# EAGLE design LED_Brightness_Adjuster (EAGLE 9.6.2)
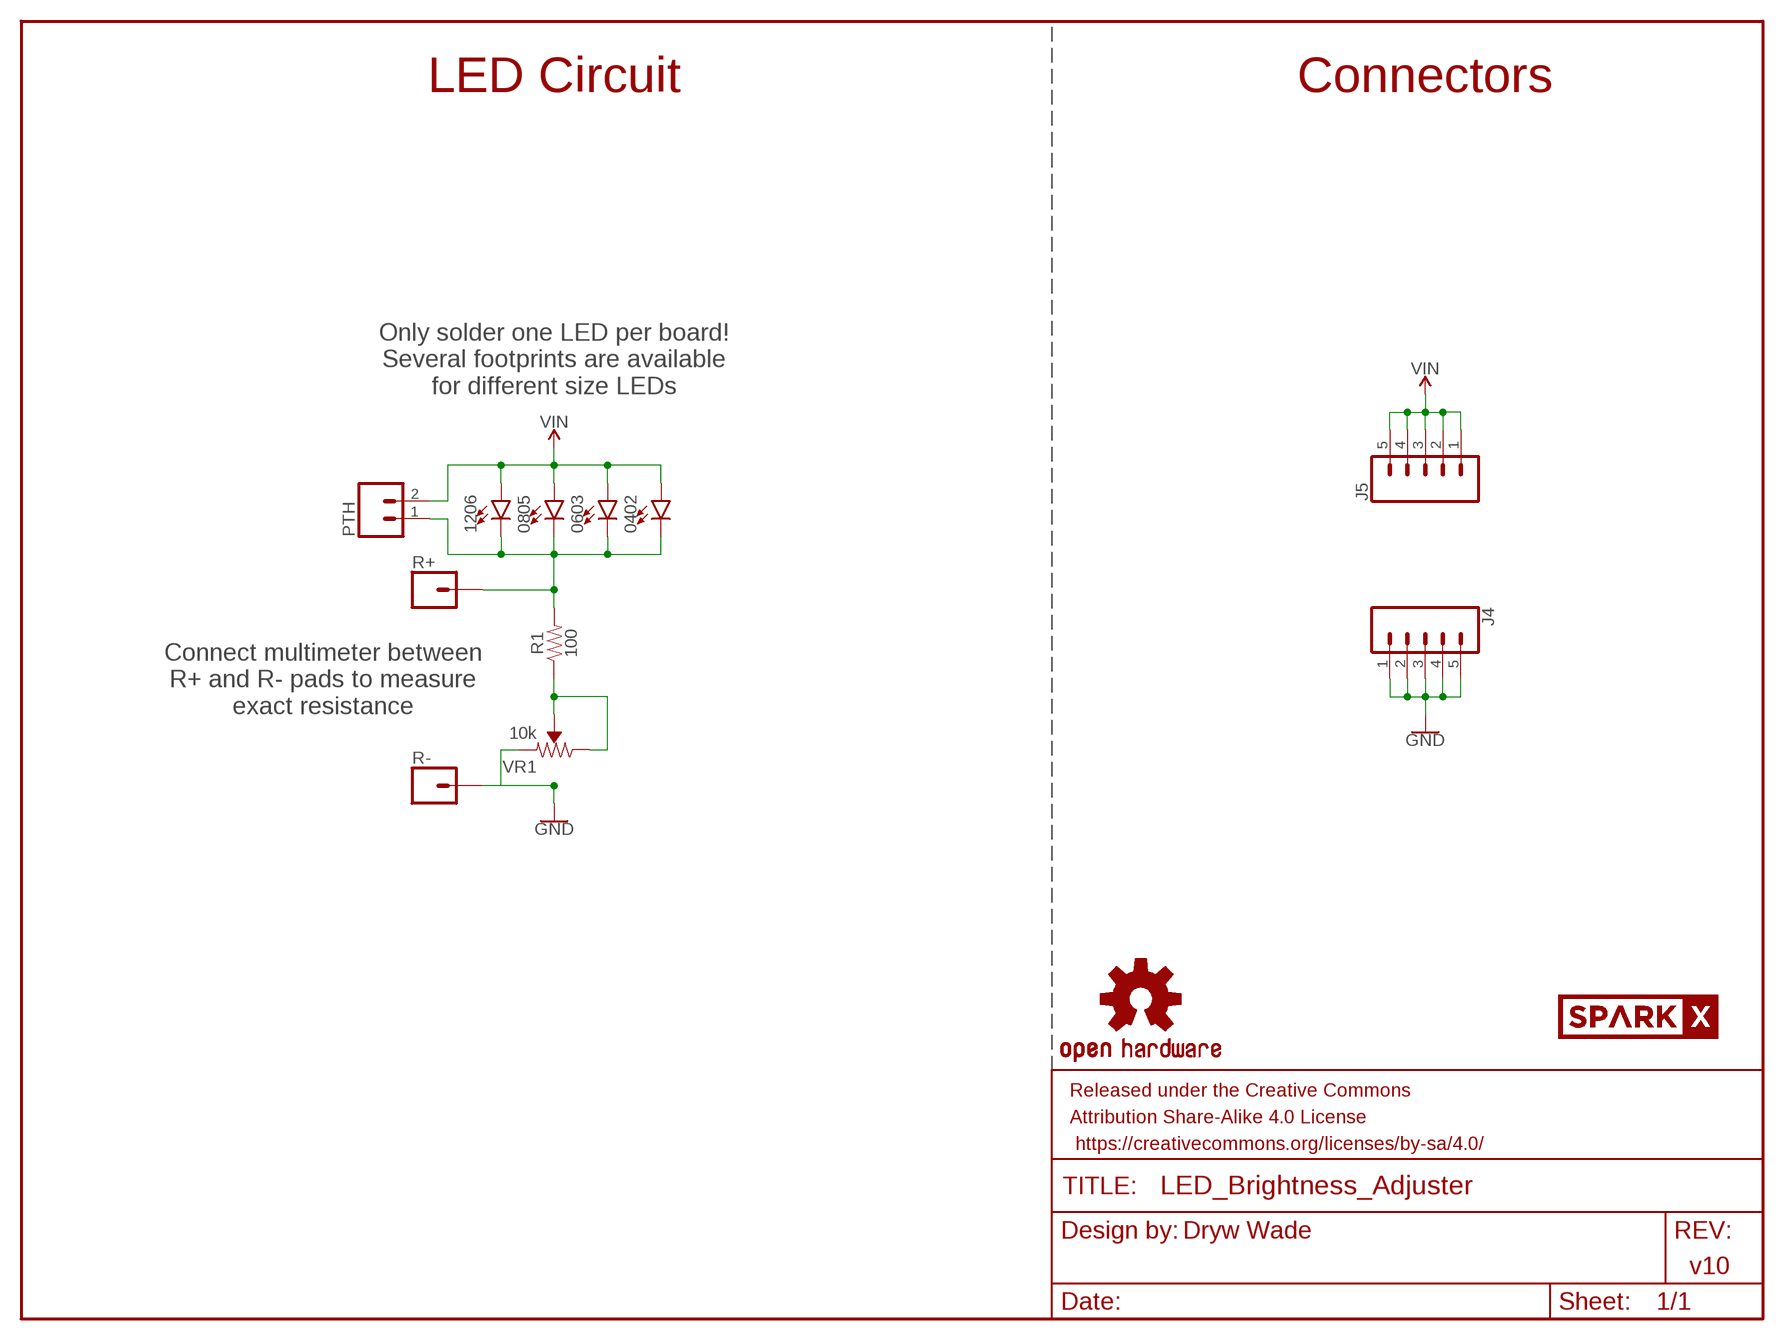
[diagram p0: schematic, sheet 1]

## Parts
0402  RED  LED-RED_0402  [LED-0402]
0603  RED  LED-RED0603  [LED-0603]
0805  RED  LED-RED-0805  [LED-0805]
1206  RED  LED-RED1206  [LED-1206]
FRAME1  FRAME-LETTER  [CREATIVE_COMMONS]
J4  CONN_05  [1X05]
J5  CONN_05  [1X05]
LOGO2  OSHW-LOGOS  [OSHW-LOGO-S]
PTH  CONN_02  [1X02]
R1  100  100OHM-HORIZ-1/4W-1%  [AXIAL-0.3]
R+  CONN_01  [1X01]
R-  CONN_01  [1X01]
U$26  SPARKX-LOGO5  [SPARKX-LARGE]
U$27  SPARKX-LOGO5  [SPARKX-LARGE]
VR1  10k  TRIMPOT-PTH-10MM-KNOB-1/2W-10%  [TRIMPOT-PTH-3386U]

## Nets
GND: J4.1 J4.2 J4.3 J4.4 J4.5 R-.1 VR1.1(CCW)
N$1: 0402.C 0603.C 0805.C 1206.C PTH.1 R1.P$2 R+.1
N$2: R1.P$1 VR1.2(WIPER) VR1.3(CW)
VIN: 0402.A 0603.A 0805.A 1206.A J5.1 J5.2 J5.3 J5.4 J5.5 PTH.2

## Notes on the sheet
- LED Circuit | Connectors
- Only solder one LED per board\!
  Several footprints are available
  for different size LEDs
- Connect multimeter between
  R+ and R- pads to measure
  exact resistance
- Dryw Wade
- v10

## Library data of the parts
0402 = SparkFun-LED:LED-RED: Red SMD LED Used in manufacturing of most products at SparkFun Packages: 0603 - SMD 0603 package [Product Link] <http://docs.avagotech.com/docs/AV02-0551EN> 0603 SMART - SMD 0603 SMART package ( more efficient and expensive)[Product Link] <http://www.osram-os.com/Graphics/XPic2/00077099_0.pdf> 1206 - SMD1206 package [Product Link] <https://www.sparkfun.com/datasheets/DevTools/LilyPad/Q150OVS4.pdff> SparkFun Products: Pro Mini 328 -5V <https://www.sparkfun.com/products/821> RedBoard <https://www.sparkfun.com/products/12757> IOIO-OTG <https://www.sparkfun.com/products/13613>; PROD_ID: DIO-16757
0603 = SparkFun-LED:LED-RED: Red SMD LED Used in manufacturing of most products at SparkFun Packages: 0603 - SMD 0603 package [Product Link] <http://docs.avagotech.com/docs/AV02-0551EN> 0603 SMART - SMD 0603 SMART package ( more efficient and expensive)[Product Link] <http://www.osram-os.com/Graphics/XPic2/00077099_0.pdf> 1206 - SMD1206 package [Product Link] <https://www.sparkfun.com/datasheets/DevTools/LilyPad/Q150OVS4.pdff> SparkFun Products: Pro Mini 328 -5V <https://www.sparkfun.com/products/821> RedBoard <https://www.sparkfun.com/products/12757> IOIO-OTG <https://www.sparkfun.com/products/13613>; PROD_ID: DIO-00819
0805 = SparkFun-LED:LED-RED: Red SMD LED Used in manufacturing of most products at SparkFun Packages: 0603 - SMD 0603 package [Product Link] <http://docs.avagotech.com/docs/AV02-0551EN> 0603 SMART - SMD 0603 SMART package ( more efficient and expensive)[Product Link] <http://www.osram-os.com/Graphics/XPic2/00077099_0.pdf> 1206 - SMD1206 package [Product Link] <https://www.sparkfun.com/datasheets/DevTools/LilyPad/Q150OVS4.pdff> SparkFun Products: Pro Mini 328 -5V <https://www.sparkfun.com/products/821> RedBoard <https://www.sparkfun.com/products/12757> IOIO-OTG <https://www.sparkfun.com/products/13613>; PROD_ID: DIO-16865
1206 = SparkFun-LED:LED-RED: Red SMD LED Used in manufacturing of most products at SparkFun Packages: 0603 - SMD 0603 package [Product Link] <http://docs.avagotech.com/docs/AV02-0551EN> 0603 SMART - SMD 0603 SMART package ( more efficient and expensive)[Product Link] <http://www.osram-os.com/Graphics/XPic2/00077099_0.pdf> 1206 - SMD1206 package [Product Link] <https://www.sparkfun.com/datasheets/DevTools/LilyPad/Q150OVS4.pdff> SparkFun Products: Pro Mini 328 -5V <https://www.sparkfun.com/products/821> RedBoard <https://www.sparkfun.com/products/12757> IOIO-OTG <https://www.sparkfun.com/products/13613>; PROD_ID: DIO-09912
FRAME1 = SparkFun-Aesthetics:FRAME-LETTER: Schematic Frame - Letter Standard 8.5x11 US Letter frame
J4 J5 = SparkFun-Connectors:CONN_05: Multi connection point. Often used as Generic Header-pin footprint for 0.1 inch spaced/style header connections On any of the 0.1 inch spaced packages, you can populate with these: Break Away Headers - Straight <https://www.sparkfun.com/products/116> (PRT-00116) Break Away Male Headers - Right Angle <https://www.sparkfun.com/products/553> (PRT-00553) Female Headers <https://www.sparkfun.com/products/115> (PRT-00115) Break Away Headers - Machine Pin <https://www.sparkfun.com/products/117> (PRT-00117) Break Away Female Headers - Swiss Machine Pin <https://www.sparkfun.com/products/743> (PRT-00743) For SCREWTERMINALS and SPRING TERMINALS visit here: Screw Terimnals on SparkFun.com <https://www.sparkfun.com/search/results?term=Screw+Terminals> (5mm/3.5mm/2.54mm spacing) This device is also useful as a general connection point to wire up your design to another part of your project. Our various solder wires solder well into these plated through hole pads. Hook-Up Wire - Assortment (Stranded, 22 AWG) <https://www.sparkfun.com/products/11375> (PRT-11375) Hook-Up Wire - Assortment (Solid Core, 22 AWG) <https://www.sparkfun.com/products/11367> (PRT-11367) View the entire wire category on our website here <https://www.sparkfun.com/categories/141> Special notes: Molex polarized connector foot print use with SKU : PRT-08231 with associated crimp pins and housings. 1MM SMD Version SKU: PRT-10208
LOGO2 = SparkFun-Aesthetics:OSHW-LOGO: Open-Source Hardware (OSHW) Logo This logo indicates the piece of hardware it is found on incorporates a OSHW license and/or adheres to the definition of open source hardware found here: http://freedomdefined.org/OSHW
PTH = SparkFun-Connectors:CONN_02: Multi connection point. Often used as Generic Header-pin footprint for 0.1 inch spaced/style header connections On any of the 0.1 inch spaced packages, you can populate with these: Break Away Headers - Straight <https://www.sparkfun.com/products/116> (PRT-00116) Break Away Male Headers - Right Angle <https://www.sparkfun.com/products/553> (PRT-00553) Female Headers <https://www.sparkfun.com/products/115> (PRT-00115) Break Away Headers - Machine Pin <https://www.sparkfun.com/products/117> (PRT-00117) Break Away Female Headers - Swiss Machine Pin <https://www.sparkfun.com/products/743> (PRT-00743) For SCREWTERMINALS and SPRING TERMINALS visit here: Screw Terimnals on SparkFun.com <https://www.sparkfun.com/search/results?term=Screw+Terminals> (5mm/3.5mm/2.54mm spacing) This device is also useful as a general connection point to wire up your design to another part of your project. Our various solder wires solder well into these plated through hole pads. Hook-Up Wire - Assortment (Stranded, 22 AWG) <https://www.sparkfun.com/products/11375> (PRT-11375) Hook-Up Wire - Assortment (Solid Core, 22 AWG) <https://www.sparkfun.com/products/11367> (PRT-11367) View the entire wire category on our website here <https://www.sparkfun.com/categories/141> Special notes: Molex polarized connector foot print use with: PRT-08233 with associated crimp pins and housings. 2.54_SCREWTERM for use with PRT-10571. 3.5mm Screw Terminal footprints for PRT-08084 5mm Screw Terminal footprints for use with PRT-08432
R1 = SparkFun-Resistors:100OHM: 100Ω resistor A resistor is a passive two-terminal electrical component that implements electrical resistance as a circuit element. Resistors act to reduce current flow, and, at the same time, act to lower voltage levels within circuits. - Wikipedia; PROD_ID: RES-12181
R+ R- = SparkFun-Connectors:CONN_01: Single connection point. Often used as Generic Header-pin footprint for 0.1 inch spaced/style header connections On any of the 0.1 inch spaced packages, you can populate with these: Break Away Headers - Straight <https://www.sparkfun.com/products/116> (PRT-00116) Break Away Male Headers - Right Angle <https://www.sparkfun.com/products/553> (PRT-00553) Female Headers <https://www.sparkfun.com/products/115> (PRT-00115) Break Away Headers - Machine Pin <https://www.sparkfun.com/products/117> (PRT-00117) Break Away Female Headers - Swiss Machine Pin <https://www.sparkfun.com/products/743> (PRT-00743) This device is also useful as a general connection point to wire up your design to another part of your project. Our various solder wires solder well into these plated through hole pads. Hook-Up Wire - Assortment (Stranded, 22 AWG) <https://www.sparkfun.com/products/11375> (PRT-11375) Hook-Up Wire - Assortment (Solid Core, 22 AWG) <https://www.sparkfun.com/products/11367> (PRT-11367) View the entire wire category on our website here <https://www.sparkfun.com/categories/141> Special notes: SMTSO-256-ET is a "flush mount" nut for a 4-40 screw. We mostly use this on specialty testbeds; it is a nice way to connect hardware to your PCB at an adjustable hieght. Also note, the SNAP packages are for using a snappable style connector. We sell a baggie of snaps and they are also used on two LilyPad designs: Snap Assortment - 30 pack (male and female) <https://www.sparkfun.com/products/11347> (DEV-11347) LilyPad Arduino SimpleSnap <https://www.sparkfun.com/products/10941> (DEV-10941) LilyPad SimpleSnap Protoboard <https://www.sparkfun.com/products/10940> (DEV-10940)
U$26 U$27 = SparkX:SPARKX-LOGO
VR1 = SparkFun-Resistors:TRIMPOT: Trimming Potentiometer (Trimpot) Three-terminal potentiometers, with an adjustable wiper and two adjustable resistors. A pot can be used to create a configurable voltage divider, or as a variable resistor. "Trimpots" are a subset of potentiometers, usually intended for "set-and-forget" applications. They're often more delicate than standard potentiometers - rated for fewer turns. Variants PTH-KNOB - PTH Trimpot w/ finger-adjustable knob Trimpot 10K with Knob <https://www.sparkfun.com/products/9806> (COM-09806) Datasheet <http://www.sparkfun.com/datasheets/Components/General/TSR-3386.pdf> SMD-3MM-CLOSED-FRAME - SMD 3mm Square Closed-Frame Trimpot Used on e.g. EasyDriver - Stepper Motor Driver <https://www.sparkfun.com/products/12779> Datasheet <http://www.bitechnologies.com/pdfs/22.pdf> (22AR10KTR) SMD-5MM - SMD 5mm Square Closed-Frame Trimpot Used on e.g. IOIO-OTG - V2.2 <https://www.sparkfun.com/products/13613> Datasheet <http://www.vishay.com/docs/51008/ts53.pdf> (TS53YL502MR10) SMD-3MM-1/10W-25% - 3mm Square Open-Frame Trimpot Used on e.g. SparkFun Shapeoko <https://www.sparkfun.com/products/13899> Datasheet <http://www.bourns.com/docs/Product-Datasheets/TC33.pdf> (TC33X-2-103E); PROD_ID: RES-09730; SF_SKU: COM-09806

## Board
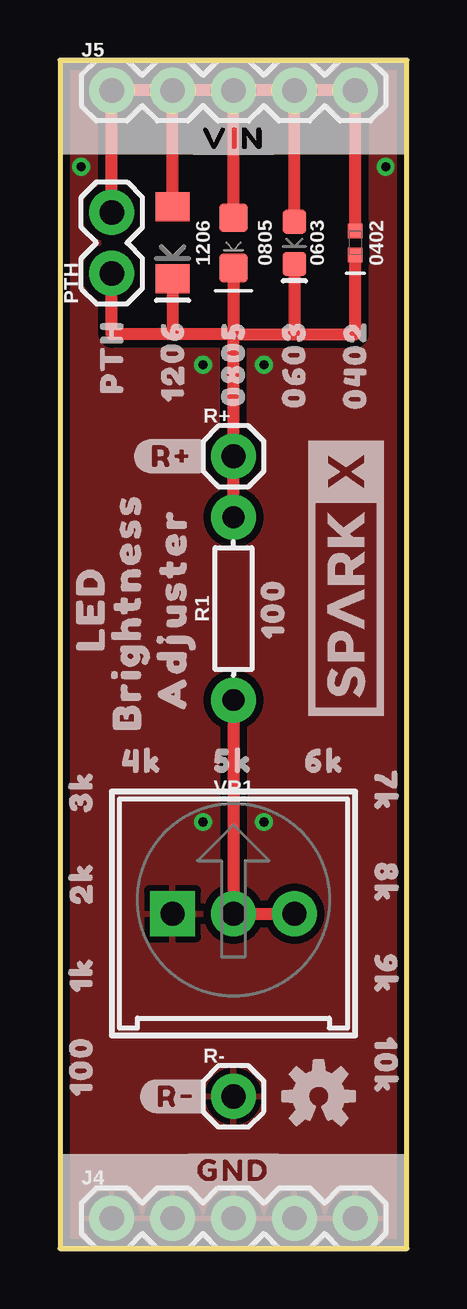
[diagram p1: board, top side]
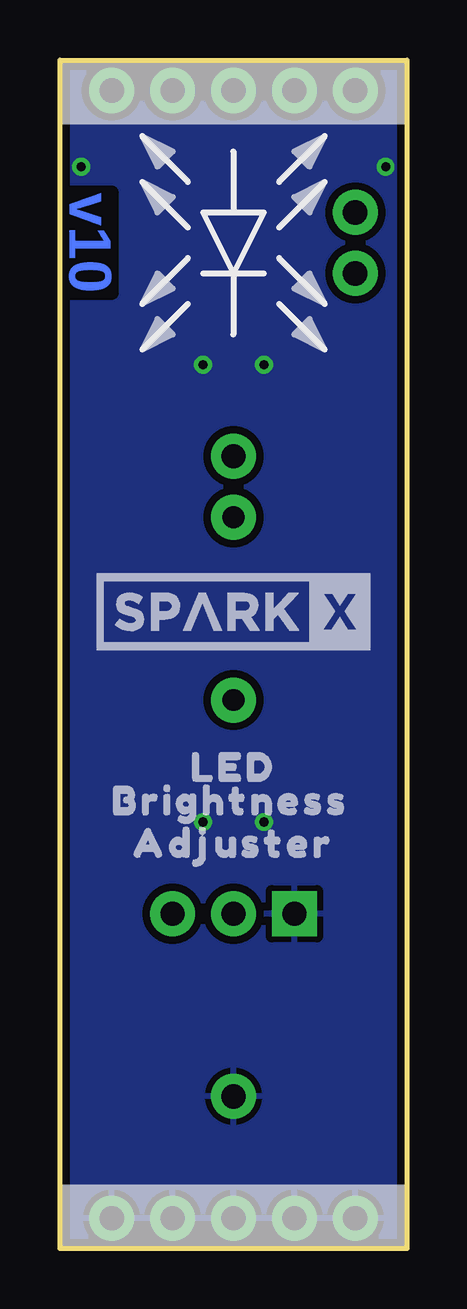
[diagram p2: board, bottom side, seen from below]

Size 14.48 x 49.53 mm. Coordinates in mm from the lower left corner, seen from the top.
Outline: 0,0 14.48,0 14.48,49.53 0,49.53 0,0
Copper layers (1*16): Top 0.035mm / dielectric 1.5mm / Bottom 0.035mm
Design rules "SparkFun-2-Layer-General-JLCPCB": minimum track width 7mil, minimum drill 0.3mm, track to track 7mil, track to pad 7mil, pad to pad 7mil, via to via 7mil, smd to smd 7mil, copper to edge 7mil, drill to drill 7mil, minimum pad ring 7mil, minimum via ring 7mil, stop-mask expansion 3mil, vias tented up to drill 25mil, thermal gap 10mil

### Footprints (pad centres in the part's own frame; a part is rotated, then mirrored left to right if it is on the bottom)
LED-0402 = smd 0.6 x 0.6: A -0.5,0; C 0.5,0
LED-0603 = smd 1 x 1: A -0.877,0; C 0.877,0
LED-0805 = smd 1.2 x 1.2: A -1.05,0; C 1.05,0
LED-1206 = smd 1.2 x 1.4: A -1.5,0; C 1.5,0
1X05 = drill 1.016 pad 1.88: 1 0,0; 2 2.54,0; 3 5.08,0; 4 7.62,0; 5 10.16,0
1X02 = drill 1.016 pad 1.88: 1 0,0; 2 2.54,0
AXIAL-0.3 = drill 0.9 pad 1.88: P$1 -3.81,0; P$2 3.81,0
1X01 = drill 1.016 pad 1.88: 1 0,0
TRIMPOT-PTH-3386U = drill 1.016 pad 1.88 square: 1 -2.54,-0.015 | drill 1.016 pad 1.88: 2 0,-0.015; 3 2.54,-0.015

### Placement (x,y rotation side)
0402  12.32,41.91 270 top
0603  9.78,41.91 270 top
0805  7.24,41.91 270 top
1206  4.7,41.91 270 top
FRAME1  -15.62,-19.05 0 top  (outside the outline)
J4  2.16,1.27 0 top
J5  2.16,48.26 0 top
LOGO2  10.79,6.35 0 top
PTH  2.16,40.64 90 top
R1  7.24,26.67 90 top
R+  7.24,33.02 0 top
R-  7.24,6.35 0 top
U$1  [4K0]  3.43,20.32 0 top
U$2  [6K0]  11.05,20.32 0 top
U$3  [1K0]  0.89,11.43 90 top
U$4  [1000]  0.89,7.62 90 top
U$5  [10K0]  13.59,7.62 270 top
U$6  [#VIN#0]  7.24,46.94 0 top
U$7  [5K0]  7.24,20.32 0 top
U$8  [1000]  8.89,26.67 90 top
U$9  [#R##0]  6.22,33.02 0 top
U$10  [ADJUSTER0]  7.24,16.89 0 bottom
U$11  [#GND#0]  7.24,2.59 0 top
U$12  [3K0]  0.89,19.05 90 top
U$13  [2K0]  0.89,15.24 90 top
U$14  [7K0]  13.59,19.05 270 top
U$15  [8K0]  13.59,15.24 270 top
U$16  [9K0]  13.59,11.43 270 top
U$17  [PTH0]  2.16,39.37 90 top
U$18  [12060]  4.7,39.37 90 top
U$19  [08050]  7.24,39.37 90 top
U$20  [04020]  12.32,39.37 90 top
U$21  [06030]  9.78,39.37 90 top
U$22  [LED0]  1.27,26.67 90 top
U$23  [ADJUSTER0]  4.7,26.67 90 top
U$24  [LED0]  7.24,20.07 0 bottom
U$25  [BRIGHTNESS0]  7.37,18.67 0 bottom
U$26  11.94,27.94 90 top
U$27  7.24,26.54 0 bottom
U$28  [BRIGHTNESS0]  2.79,26.54 90 top
U$29  [#R##2]  6.35,6.35 0 top
VR1  7.24,13.97 0 top

### Tracks (layer width: path | path; a pad name or v marks a point on that pad's centre or on a via)
GND  (via drill 0.38)
  other vias: 0.89,45.09 13.59,45.09 8.51,36.83 5.97,36.83 5.97,17.78 8.51,17.78
  pour Top (isolate 0.305): 0,0 14.48,0 14.48,49.53 0,49.53
  pour Bottom (isolate 0.305): 14.48,0 0,0 0,49.53 14.48,49.53
N$1
  Top 0.508: R1.P$2 R+.1 7.24,38.1 | 7.24,38.1 4.7,38.1 | 4.7,38.1 2.16,38.1 PTH.1 | 7.24,38.1 9.78,38.1 | 9.78,38.1 12.32,38.1 0402.C | 0603.C 9.78,38.1 | 1206.C 4.7,38.1 | 0805.C 7.24,38.1
N$2
  Top 0.508: R1.P$1 VR1.2 VR1.3
VIN
  Top 0.508: J5.4 J5.5 0402.A | J5.4 J5.3 | J5.3 J5.2 | J5.2 J5.1 PTH.2 | 1206.A J5.2 | 0603.A J5.4 | 0805.A J5.3

### Text on the board
Bottom: v10
Measures: Units: inches
tDocu: Dryw Wade